# Altium schematic sheet 单片机系统电路.SchDoc
size A4
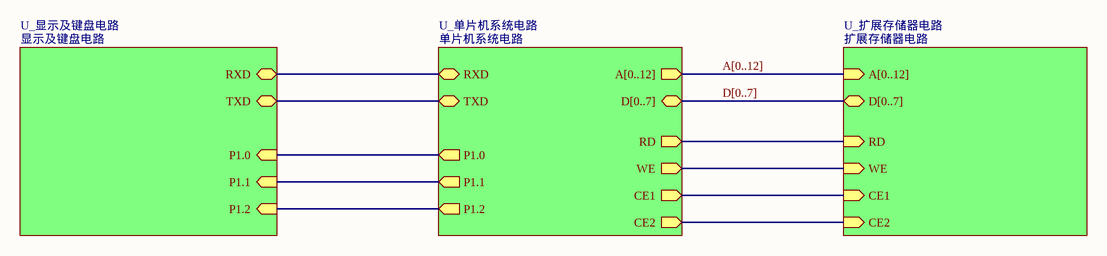
[diagram p0: 单片机系统电路.SchDoc]

## Sub-sheets
U_单片机系统电路 = 单片机系统电路: P1.1 (out), P1.2 (out), RXD (bidir), TXD (bidir), P1.0 (out), WE (out), CE1 (out), CE2 (out), RD (out), A[0..12] (out), D[0..7] (bidir)
U_扩展存储器电路 = 扩展存储器电路: WE (in), CE1 (in), CE2 (in), RD (in), A[0..12] (in), D[0..7] (bidir)
U_显示及键盘电路 = 显示及键盘电路: P1.1 (in), P1.2 (in), P1.0 (in), RXD (bidir), TXD (bidir)

## Nets
(unnamed): sheet U_单片机系统电路/P1.1, sheet U_显示及键盘电路/P1.1
(unnamed): sheet U_单片机系统电路/P1.2, sheet U_显示及键盘电路/P1.2
(unnamed): sheet U_单片机系统电路/RXD, sheet U_显示及键盘电路/RXD
(unnamed): sheet U_单片机系统电路/TXD, sheet U_显示及键盘电路/TXD
(unnamed): sheet U_单片机系统电路/P1.0, sheet U_显示及键盘电路/P1.0
(unnamed): sheet U_单片机系统电路/WE, sheet U_扩展存储器电路/WE
(unnamed): sheet U_单片机系统电路/CE1, sheet U_扩展存储器电路/CE1
(unnamed): sheet U_单片机系统电路/CE2, sheet U_扩展存储器电路/CE2
(unnamed): sheet U_单片机系统电路/RD, sheet U_扩展存储器电路/RD

## Buses and harness runs
bus A[0..12] = sheet U_单片机系统电路/A[0..12] = sheet U_扩展存储器电路/A[0..12]
bus D[0..7] = sheet U_单片机系统电路/D[0..7] = sheet U_扩展存储器电路/D[0..7]